# EAGLE design TD4Lite (EAGLE 9.2.2)
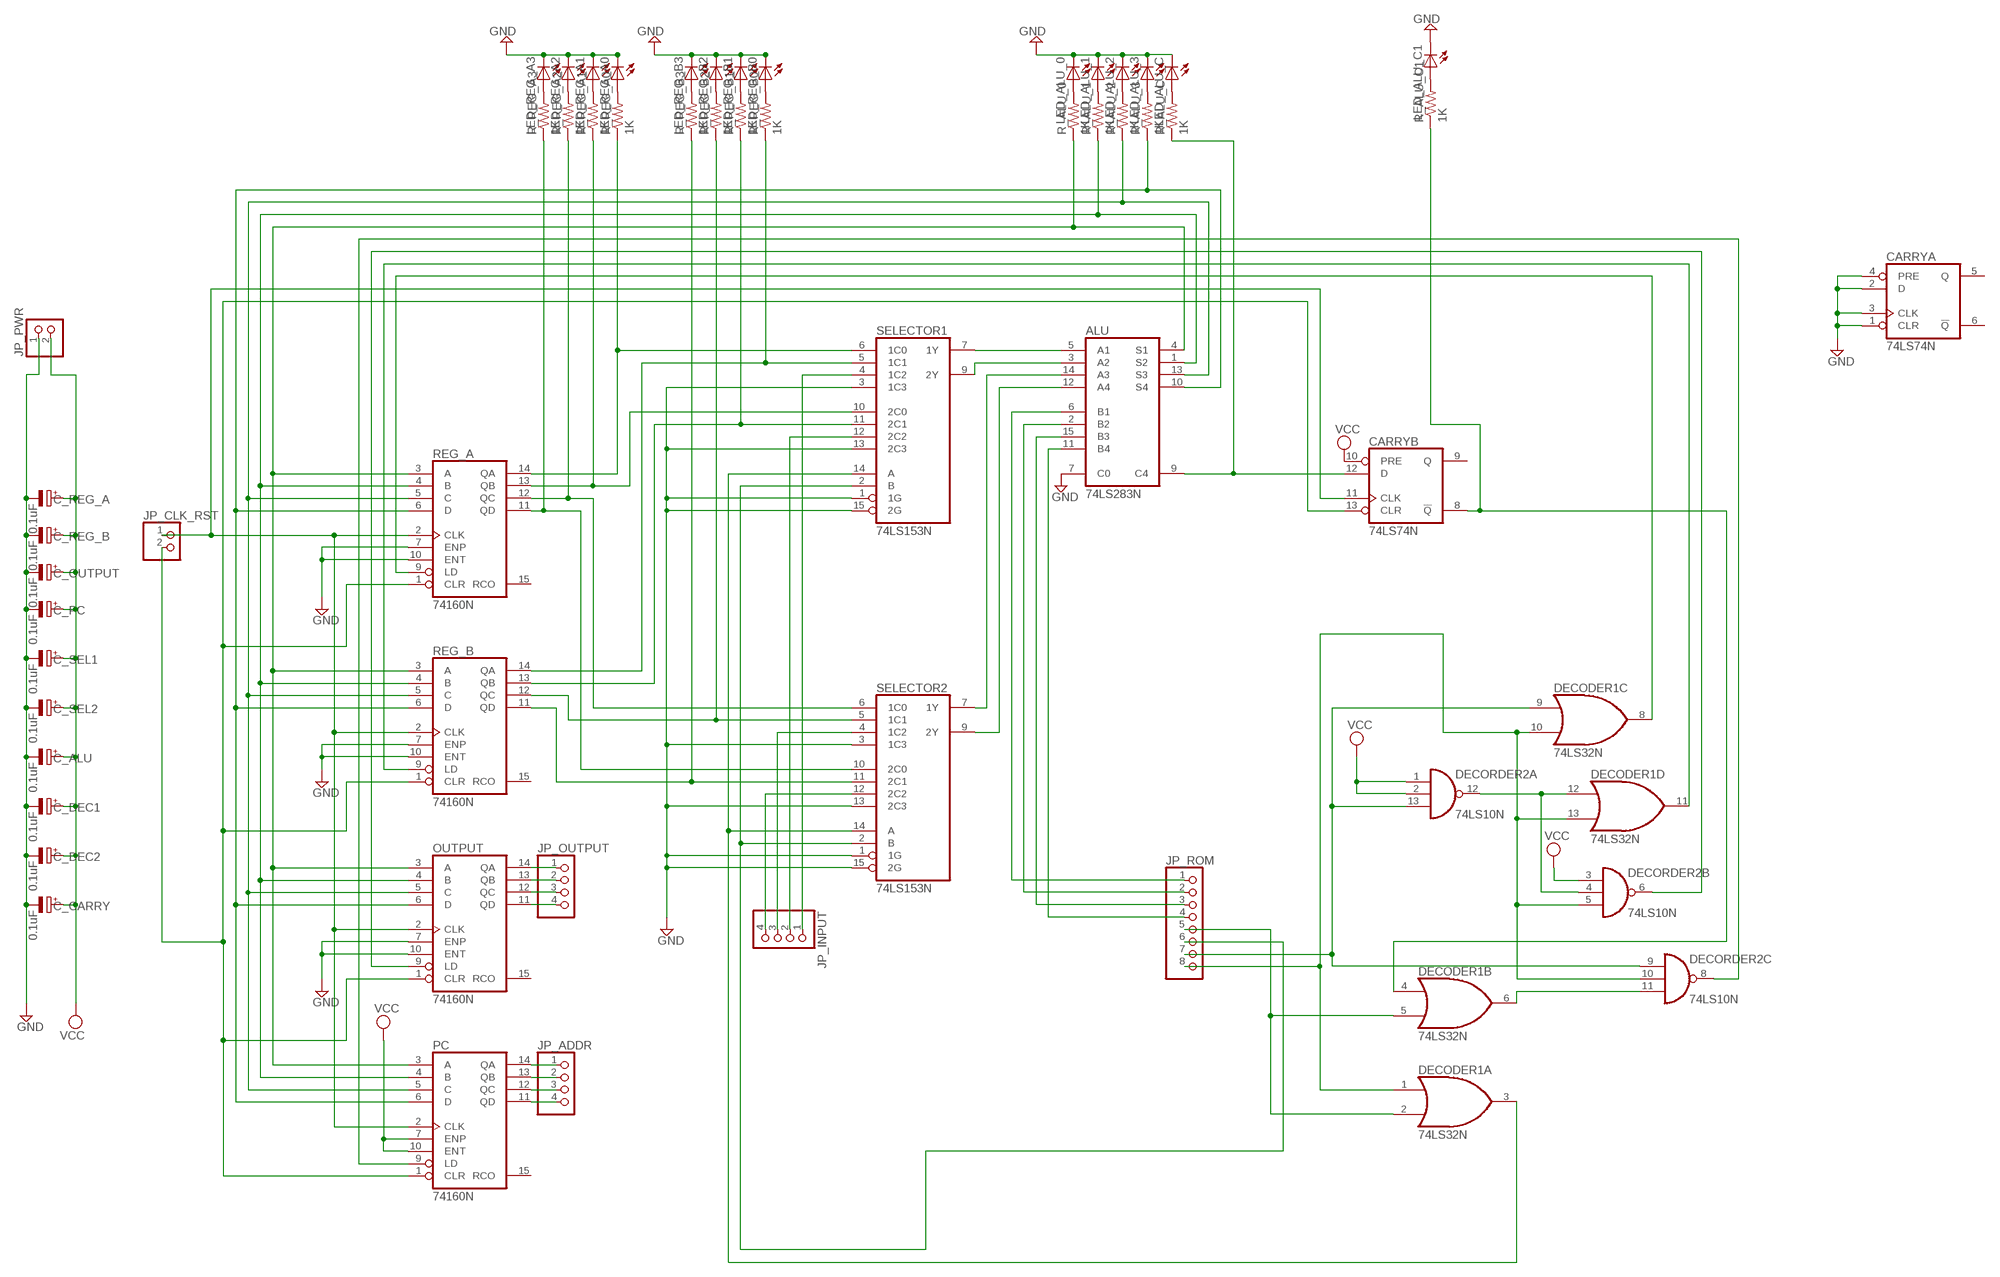
[diagram p0: schematic, sheet 1]

## Parts
ALU  74LS283N  [DIL16]
C_ALU  0.1uF  CPOL-EUE2-5  [E2-5]
C_CARRY  0.1uF  CPOL-EUE2-5  [E2-5]
C_DEC1  0.1uF  CPOL-EUE2-5  [E2-5]
C_DEC2  0.1uF  CPOL-EUE2-5  [E2-5]
C_OUTPUT  0.1uF  CPOL-EUE2-5  [E2-5]
C_PC  0.1uF  CPOL-EUE2-5  [E2-5]
C_REG_A  0.1uF  CPOL-EUE2-5  [E2-5]
C_REG_B  0.1uF  CPOL-EUE2-5  [E2-5]
C_SEL1  0.1uF  CPOL-EUE2-5  [E2-5]
C_SEL2  0.1uF  CPOL-EUE2-5  [E2-5]
CARRY  74LS74N  [DIL14]
DECODER1  74LS32N  [DIL14]
DECORDER2  74LS10N  [DIL14]
JP_ADDR  PINHD-1X4  [1X04]
JP_CLK_RST  PINHD-1X2  [1X02]
JP_INPUT  PINHD-1X4  [1X04]
JP_OUTPUT  PINHD-1X4  [1X04]
JP_PWR  PINHD-1X2  [1X02]
JP_ROM  PINHD-1X8  [1X08]
LED_ALU_0  LED5MM  [LED5MM]
LED_ALU_1  LED5MM  [LED5MM]
LED_ALU_2  LED5MM  [LED5MM]
LED_ALU_3  LED5MM  [LED5MM]
LED_ALU_C  LED5MM  [LED5MM]
LED_ALU_C1  LED5MM  [LED5MM]
LED_REG_A0  LED5MM  [LED5MM]
LED_REG_A1  LED5MM  [LED5MM]
LED_REG_A2  LED5MM  [LED5MM]
LED_REG_A3  LED5MM  [LED5MM]
LED_REG_B0  LED5MM  [LED5MM]
LED_REG_B1  LED5MM  [LED5MM]
LED_REG_B2  LED5MM  [LED5MM]
LED_REG_B3  LED5MM  [LED5MM]
OUTPUT  74160N  [DIL16]
PC  74160N  [DIL16]
R_ALU_0  1K  R-US_0204/7  [0204/7]
R_ALU_1  1K  R-US_0204/7  [0204/7]
R_ALU_2  1K  R-US_0204/7  [0204/7]
R_ALU_3  1K  R-US_0204/7  [0204/7]
R_ALU_C  1K  R-US_0204/7  [0204/7]
R_ALU_C1  1K  R-US_0204/7  [0204/7]
R_REG_A0  1K  R-US_0204/7  [0204/7]
R_REG_A1  1K  R-US_0204/7  [0204/7]
R_REG_A2  1K  R-US_0204/7  [0204/7]
R_REG_A3  1K  R-US_0204/7  [0204/7]
R_REG_B0  1K  R-US_0204/7  [0204/7]
R_REG_B1  1K  R-US_0204/7  [0204/7]
R_REG_B2  1K  R-US_0204/7  [0204/7]
R_REG_B3  1K  R-US_0204/7  [0204/7]
REG_A  74160N  [DIL16]
REG_B  74160N  [DIL16]
SELECTOR1  74LS153N  [DIL16]
SELECTOR2  74LS153N  [DIL16]

## Nets
CLK: CARRY.11(B:CLK) JP_CLK_RST.1 OUTPUT.2(CLK) PC.2(CLK) REG_A.2(CLK) REG_B.2(CLK)
DATA_0: ALU.6(B1) JP_ROM.1
DATA_1: ALU.2(B2) JP_ROM.2
DATA_2: ALU.15(B3) JP_ROM.3
DATA_3: ALU.11(B4) JP_ROM.4
DATA_4: DECODER1.2(A:I1) DECODER1.5(B:I1) JP_ROM.5
DATA_5: JP_ROM.6 SELECTOR1.2(B) SELECTOR2.2(B)
DATA_6: DECODER1.9(C:I0) DECORDER2.9(C:I0) DECORDER2.13(A:I2) JP_ROM.7
DATA_7: DECODER1.1(A:I0) DECODER1.10(C:I1) DECODER1.13(D:I1) DECORDER2.5(B:I2) DECORDER2.10(C:I1) JP_ROM.8
GND: ALU.7(C0) C_ALU.- C_CARRY.- C_DEC1.- C_DEC2.- C_OUTPUT.- C_PC.- C_REG_A.- C_REG_B.- C_SEL1.- C_SEL2.- CARRY.1(A:CLR) CARRY.2(A:D) CARRY.3(A:CLK) CARRY.4(A:PRE) JP_PWR.1 LED_ALU_0.K(C) LED_ALU_1.K(C) LED_ALU_2.K(C) LED_ALU_3.K(C) LED_ALU_C1.K(C) LED_ALU_C.K(C) LED_REG_A0.K(C) LED_REG_A1.K(C) LED_REG_A2.K(C) LED_REG_A3.K(C) LED_REG_B0.K(C) LED_REG_B1.K(C) LED_REG_B2.K(C) LED_REG_B3.K(C) OUTPUT.7(ENP) OUTPUT.10(ENT) REG_A.7(ENP) REG_A.10(ENT) REG_B.7(ENP) REG_B.10(ENT) SELECTOR1.1(1G) SELECTOR1.3(1C3) SELECTOR1.13(2C3) SELECTOR1.15(2G) SELECTOR2.1(1G) SELECTOR2.3(1C3) SELECTOR2.13(2C3) SELECTOR2.15(2G)
N$1: LED_ALU_0.A R_ALU_0.2
N$2: LED_ALU_1.A R_ALU_1.2
N$3: LED_ALU_2.A R_ALU_2.2
N$4: LED_ALU_3.A R_ALU_3.2
N$5: ALU.4(S1) OUTPUT.3(A) PC.3(A) R_ALU_0.1 REG_A.3(A) REG_B.3(A)
N$6: LED_ALU_C.A R_ALU_C.2
N$7: ALU.1(S2) OUTPUT.4(B) PC.4(B) R_ALU_1.1 REG_A.4(B) REG_B.4(B)
N$8: ALU.13(S3) OUTPUT.5(C) PC.5(C) R_ALU_2.1 REG_A.5(C) REG_B.5(C)
N$9: ALU.10(S4) OUTPUT.6(D) PC.6(D) R_ALU_3.1 REG_A.6(D) REG_B.6(D)
N$10: LED_ALU_C1.A R_ALU_C1.2
N$11: CARRY.8(B:!Q) DECODER1.4(B:I0) R_ALU_C1.1
N$18: LED_REG_A3.A R_REG_A3.2
N$19: LED_REG_A2.A R_REG_A2.2
N$20: LED_REG_A1.A R_REG_A1.2
N$21: LED_REG_A0.A R_REG_A0.2
N$22: LED_REG_B3.A R_REG_B3.2
N$23: LED_REG_B2.A R_REG_B2.2
N$24: LED_REG_B1.A R_REG_B1.2
N$25: LED_REG_B0.A R_REG_B0.2
N$26: JP_INPUT.1 SELECTOR1.4(1C2)
N$27: JP_INPUT.2 SELECTOR1.12(2C2)
N$28: JP_INPUT.3 SELECTOR2.4(1C2)
N$29: JP_INPUT.4 SELECTOR2.12(2C2)
N$30: ALU.5(A1) SELECTOR1.7(1Y)
N$31: ALU.3(A2) SELECTOR1.9(2Y)
N$32: ALU.14(A3) SELECTOR2.7(1Y)
N$33: ALU.12(A4) SELECTOR2.9(2Y)
N$34: JP_OUTPUT.4 OUTPUT.11(QD)
N$35: JP_OUTPUT.2 OUTPUT.13(QB)
N$36: JP_OUTPUT.1 OUTPUT.14(QA)
N$37: JP_OUTPUT.3 OUTPUT.12(QC)
N$38: JP_ADDR.1 PC.14(QA)
N$39: JP_ADDR.2 PC.13(QB)
N$40: JP_ADDR.3 PC.12(QC)
N$41: JP_ADDR.4 PC.11(QD)
N$46: ALU.9(C4) CARRY.12(B:D) R_ALU_C.1
N$47: DECODER1.3(A:O) SELECTOR1.14(A) SELECTOR2.14(A)
N$52: DECODER1.8(C:O) REG_A.9(LD)
N$53: DECODER1.12(D:I0) DECORDER2.4(B:I1) DECORDER2.12(A:O)
N$54: DECODER1.11(D:O) REG_B.9(LD)
N$56: DECODER1.6(B:O) DECORDER2.11(C:I2)
N$57: DECORDER2.6(B:O) OUTPUT.9(LD)
N$59: DECORDER2.8(C:O) PC.9(LD)
REG_A0: R_REG_A0.1 REG_A.14(QA) SELECTOR1.6(1C0)
REG_A1: R_REG_A1.1 REG_A.13(QB) SELECTOR1.10(2C0)
REG_A2: R_REG_A2.1 REG_A.12(QC) SELECTOR2.6(1C0)
REG_A3: R_REG_A3.1 REG_A.11(QD) SELECTOR2.10(2C0)
REG_B0: R_REG_B0.1 REG_B.14(QA) SELECTOR1.5(1C1)
REG_B1: R_REG_B1.1 REG_B.13(QB) SELECTOR1.11(2C1)
REG_B2: R_REG_B2.1 REG_B.12(QC) SELECTOR2.5(1C1)
REG_B3: R_REG_B3.1 REG_B.11(QD) SELECTOR2.11(2C1)
RST: CARRY.13(B:CLR) JP_CLK_RST.2 OUTPUT.1(CLR) PC.1(CLR) REG_A.1(CLR) REG_B.1(CLR)
VCC: C_ALU.+ C_CARRY.+ C_DEC1.+ C_DEC2.+ C_OUTPUT.+ C_PC.+ C_REG_A.+ C_REG_B.+ C_SEL1.+ C_SEL2.+ CARRY.10(B:PRE) DECORDER2.1(A:I0) DECORDER2.2(A:I1) DECORDER2.3(B:I0) JP_PWR.2 PC.7(ENP) PC.10(ENT)
Unconnected: CARRY.5(A:Q) CARRY.6(A:!Q) CARRY.9(B:Q) OUTPUT.15(RCO) PC.15(RCO) REG_A.15(RCO) REG_B.15(RCO)

## Power pins joined to a net without a drawn wire
GND: ALU.8(GND) CARRY.7(P:GND) DECODER1.7(P:GND) DECORDER2.7(P:GND) OUTPUT.8(GND) PC.8(GND) REG_A.8(GND) REG_B.8(GND) SELECTOR1.8(GND) SELECTOR2.8(GND)
VCC: ALU.16(VCC) CARRY.14(P:VCC) DECODER1.14(P:VCC) DECORDER2.14(P:VCC) OUTPUT.16(VCC) PC.16(VCC) REG_A.16(VCC) REG_B.16(VCC) SELECTOR1.16(VCC) SELECTOR2.16(VCC)

## Library data of the parts
ALU = 74xx-us:74*283: 4-bit binary FULL ADDER, fast carry
C_ALU C_CARRY C_DEC1 C_DEC2 C_OUTPUT C_PC C_REG_A C_REG_B C_SEL1 C_SEL2 = rcl:CPOL-EU: POLARIZED CAPACITOR, European symbol; SPICEPREFIX: C
CARRY = 74xx-us:74*74: Dual D type positive edge triggered FLIP FLOP, preset and clear
DECODER1 = 74xx-us:74*32: Quad 2-input OR gate
DECORDER2 = 74xx-eu:74*10: Triple 3-input NAND gate
JP_ADDR JP_INPUT JP_OUTPUT = pinhead:PINHD-1X4: PIN HEADER
JP_CLK_RST JP_PWR = pinhead:PINHD-1X2: PIN HEADER
JP_ROM = pinhead:PINHD-1X8: PIN HEADER
LED_ALU_0 LED_ALU_1-LED_ALU_3 LED_ALU_C LED_ALU_C1 LED_REG_A0 LED_REG_A1-LED_REG_A3 LED_REG_B0 LED_REG_B1-LED_REG_B3 = led:LED: LED OSRAM: - CHIPLED LG R971, LG N971, LY N971, LG Q971, LY Q971, LO R971, LY R971 LH N974, LH R974 LS Q976, LO Q976, LY Q976 LO Q996 - Hyper CHIPLED LW Q18S LB Q993, LB Q99A, LB R99A - SideLED LS A670, LO A670, LY A670, LG A670, LP A670 LB A673, LV A673, LT A673, LW A673 LH A674 LY A675 LS A676, LA A676, LO A676, LY A676, LW A676 LS A679, LY A679, LG A679 - Hyper Micro SIDELED® LS Y876, LA Y876, LO Y876, LY Y876 LT Y87S - SmartLED LW L88C, LW L88S LB L89C, LB L89S, LG L890 LS L89K, LO L89K, LY L89K LS L896, LA L896, LO L896, LY L896 - TOPLED LS T670, LO T670, LY T670, LG T670, LP T670 LSG T670, LSP T670, LSY T670, LOP T670, LYG T670 LG T671, LOG T671, LSG T671 LB T673, LV T673, LT T673, LW T673 LH T674 LS T676, LA T676, LO T676, LY T676, LB T676, LH T676, LSB T676, LW T676 LB T67C, LV T67C, LT T67C, LS T67K, LO T67K, LY T67K, LW E67C LS E67B, LA E67B, LO E67B, LY E67B, LB E67C, LV E67C, LT E67C LW T67C LS T679, LY T679, LG T679 LS T770, LO T770, LY T770, LG T770, LP T770 LB T773, LV T773, LT T773, LW T773 LH T774 LS E675, LA E675, LY E675, LS T675 LS T776, LA T776, LO T776, LY T776, LB T776 LHGB T686 LT T68C, LB T68C - Hyper Mini TOPLED® LB M676 - Mini TOPLED Santana® LG M470 LS M47K, LO M47K, LY M47K Source: http://www.osram.convergy.de LUXEON: - LUMILED® LXK2-PW12-R00, LXK2-PW12-S00, LXK2-PW14-U00, LXK2-PW14-V00 LXK2-PM12-R00, LXK2-PM12-S00, LXK2-PM14-U00 LXK2-PE12-Q00, LXK2-PE12-R00, LXK2-PE12-S00, LXK2-PE14-T00, LXK2-PE14-U00 LXK2-PB12-K00, LXK2-PB12-L00, LXK2-PB12-M00, LXK2-PB14-N00, LXK2-PB14-P00, LXK2-PB14-Q00 LXK2-PR12-L00, LXK2-PR12-M00, LXK2-PR14-Q00, LXK2-PR14-R00 LXK2-PD12-Q00, LXK2-PD12-R00, LXK2-PD12-S00 LXK2-PH12-R00, LXK2-PH12-S00 LXK2-PL12-P00, LXK2-PL12-Q00, LXK2-PL12-R00 Source: www.luxeon.com KINGBRIGHT: KA-3528ASYC Source: www.kingbright.com
OUTPUT PC REG_A REG_B = 74xx-us:74*160: Synchronous 4-bit COUNTER
R_ALU_0 R_ALU_1-R_ALU_3 R_ALU_C R_ALU_C1 R_REG_A0 R_REG_A1-R_REG_A3 R_REG_B0 R_REG_B1-R_REG_B3 = rcl:R-US_: RESISTOR, American symbol; SPICEPREFIX: R
SELECTOR1 SELECTOR2 = 74xx-us:74*153: Dual 4-line to 1-line data SELECTOR/MULTIPLEXER

## Board
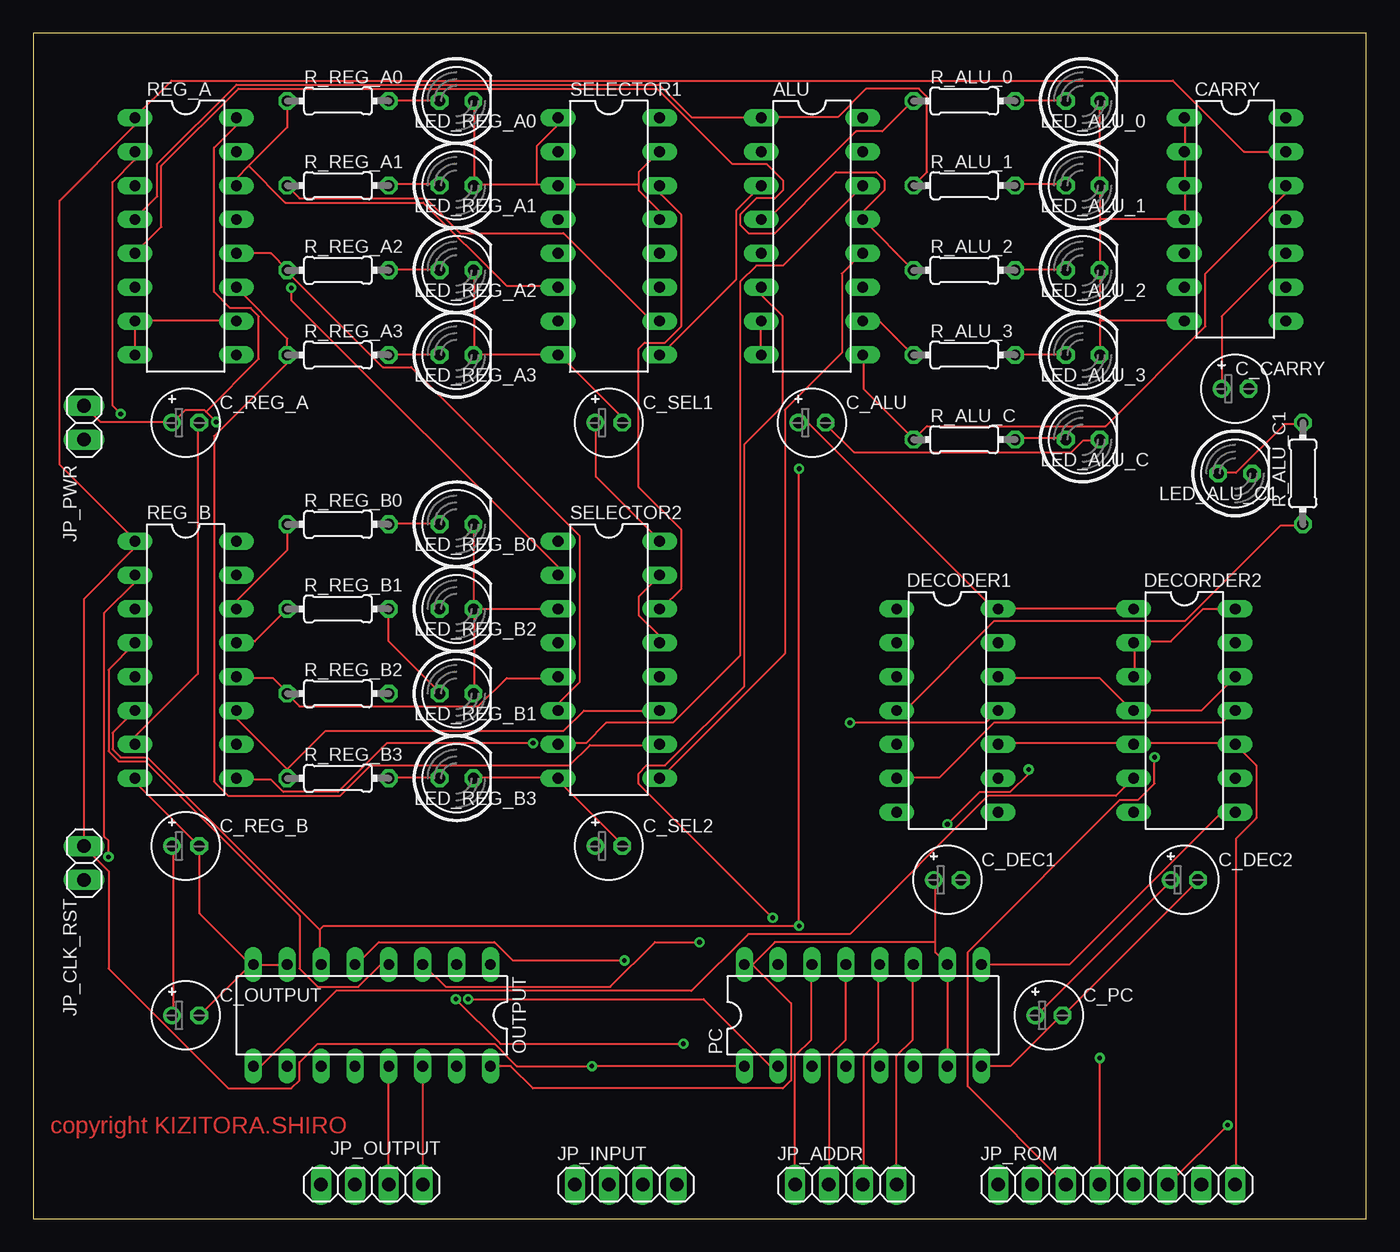
[diagram p1: board, top side]
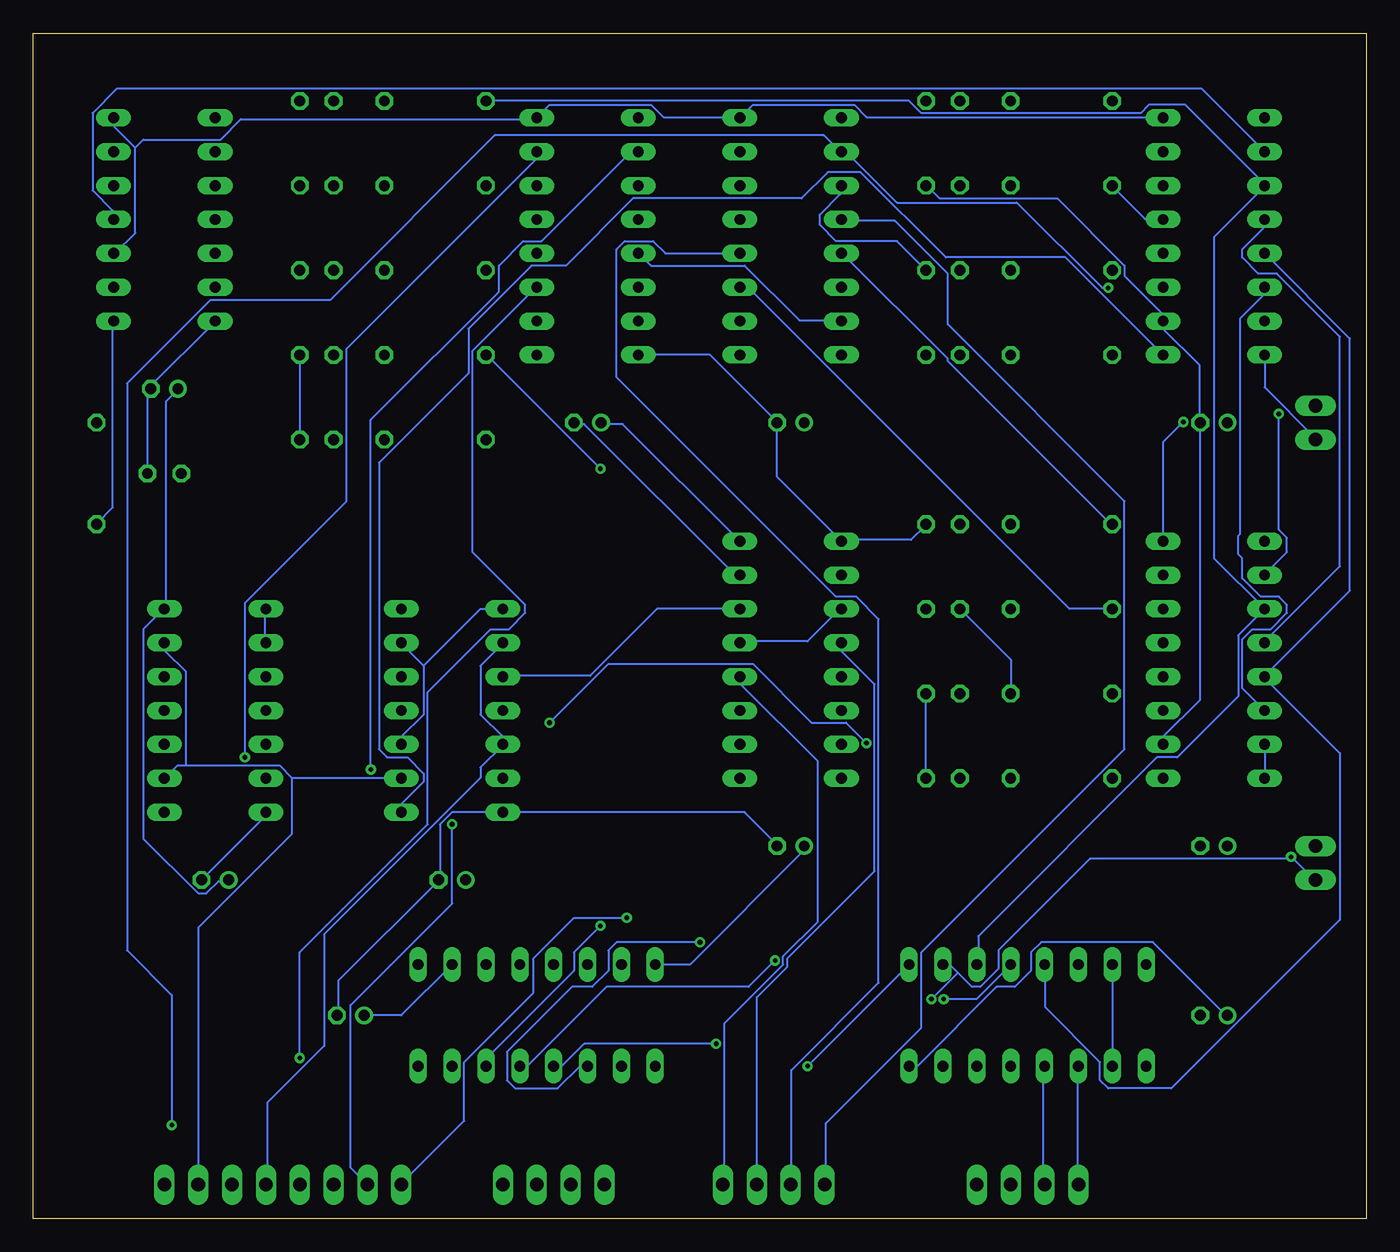
[diagram p2: board, bottom side, seen from below]

Size 100 x 88.89 mm. Coordinates in mm from the lower left corner, seen from the top.
Outline: 0,0 100,0 100,88.89 0,88.89 0,0
Copper layers (1*16): Top 0.035mm / dielectric 1.5mm / Bottom 0.035mm
Design rules "default": minimum track width 6mil, minimum drill 0.35mm, track to track 6mil, track to pad 6mil, pad to pad 6mil, via to via 6mil, smd to smd 6mil, copper to edge 40mil, drill to drill 6mil, minimum pad ring 10mil, minimum via ring 8mil, stop-mask expansion 4mil, vias tented up to drill 0mil, thermal gap 10mil

### Footprints (pad centres in the part's own frame; a part is rotated, then mirrored left to right if it is on the bottom)
DIL16 = drill 0.813 long: 1 -8.89,-3.81; 2 -6.35,-3.81; 3 -3.81,-3.81; 4 -1.27,-3.81; 5 1.27,-3.81; 6 3.81,-3.81; 7 6.35,-3.81; 8 8.89,-3.81; 9 8.89,3.81; 10 6.35,3.81; 11 3.81,3.81; 12 1.27,3.81; 13 -1.27,3.81; 14 -3.81,3.81; 15 -6.35,3.81; 16 -8.89,3.81
E2-5 = drill 0.813 pad 1.27: + -1.016,0 | drill 0.813 pad 1.27 octagon: - 1.016,0
DIL14 = drill 0.813 long: 1 -7.62,-3.81; 2 -5.08,-3.81; 3 -2.54,-3.81; 4 0,-3.81; 5 2.54,-3.81; 6 5.08,-3.81; 7 7.62,-3.81; 8 7.62,3.81; 9 5.08,3.81; 10 2.54,3.81; 11 0,3.81; 12 -2.54,3.81; 13 -5.08,3.81; 14 -7.62,3.81
1X04 = drill 1.016 long: 1 -3.81,0; 2 -1.27,0; 3 1.27,0; 4 3.81,0
1X02 = drill 1.016 long: 1 -1.27,0; 2 1.27,0
1X08 = drill 1.016 long: 1 -8.89,0; 2 -6.35,0; 3 -3.81,0; 4 -1.27,0; 5 1.27,0; 6 3.81,0; 7 6.35,0; 8 8.89,0
LED5MM = drill 0.813 octagon: A -1.27,0; K 1.27,0
0204/7 = drill 0.813 octagon: 1 -3.81,0; 2 3.81,0

### Placement (x,y rotation side)
ALU  58.42,73.66 270 top
C_ALU  58.42,59.69 0 top
C_CARRY  90.17,62.23 0 top
C_DEC1  68.58,25.4 0 top
C_DEC2  86.36,25.4 0 top
C_OUTPUT  11.43,15.24 0 top
C_PC  76.2,15.24 0 top
C_REG_A  11.43,59.69 0 top
C_REG_B  11.43,27.94 0 top
C_SEL1  43.18,59.69 0 top
C_SEL2  43.18,27.94 0 top
CARRY  90.17,74.93 270 top
DECODER1  68.58,38.1 270 top
DECORDER2  86.36,38.1 270 top
JP_ADDR  60.96,2.54 0 top
JP_CLK_RST  3.81,26.67 90 top
JP_INPUT  44.45,2.54 0 top
JP_OUTPUT  25.4,2.54 180 top
JP_PWR  3.81,59.69 90 top
JP_ROM  81.28,2.54 0 top
LED_ALU_0  78.74,83.82 0 top
LED_ALU_1  78.74,77.47 0 top
LED_ALU_2  78.74,71.12 0 top
LED_ALU_3  78.74,64.77 0 top
LED_ALU_C  78.74,58.42 0 top
LED_ALU_C1  90.17,55.88 0 top
LED_REG_A0  31.75,83.82 0 top
LED_REG_A1  31.75,77.47 0 top
LED_REG_A2  31.75,71.12 0 top
LED_REG_A3  31.75,64.77 0 top
LED_REG_B0  31.75,52.07 0 top
LED_REG_B1  31.75,39.37 0 top
LED_REG_B2  31.75,45.72 0 top
LED_REG_B3  31.75,33.02 0 top
OUTPUT  25.4,15.24 180 top
PC  62.23,15.24 0 top
R_ALU_0  69.85,83.82 0 top
R_ALU_1  69.85,77.47 0 top
R_ALU_2  69.85,71.12 0 top
R_ALU_3  69.85,64.77 0 top
R_ALU_C  69.85,58.42 0 top
R_ALU_C1  95.25,55.88 90 top
R_REG_A0  22.86,83.82 0 top
R_REG_A1  22.86,77.47 0 top
R_REG_A2  22.86,71.12 0 top
R_REG_A3  22.86,64.77 0 top
R_REG_B0  22.86,52.07 0 top
R_REG_B1  22.86,45.72 0 top
R_REG_B2  22.86,39.37 0 top
R_REG_B3  22.86,33.02 0 top
REG_A  11.43,73.66 270 top
REG_B  11.43,41.91 270 top
SELECTOR1  43.18,73.66 270 top
SELECTOR2  43.18,41.91 270 top

### Tracks (layer width: path | path; a pad name or v marks a point on that pad's centre or on a via)
CLK  (via drill 0.35)
  Top 0.152: REG_B.2 7.62,47.7 5.33,45.41 5.33,28.65 5.64,28.35 v5.64,27.13 | REG_A.2 7.62,79.4 5.94,77.72 5.94,60.96 v6.55,60.35 | PC.2 55.32,11.43 50.29,16.46 v32.61,16.46
  Bottom 0.152: 5.49,26.98 3.81,25.3 JP_CLK_RST.1 | v6.55,60.35 6.55,51.66 5.94,51.05 5.94,49.99 7.62,48.31 REG_B.2 | OUTPUT.2 31.24,19.05 30.63,18.44 | 30.63,18.44 29.57,17.37 28.96,17.37 27.58,18.75 27.58,20.12 20.73,26.98 5.49,26.98 | 5.49,26.98 v5.64,27.13 | 30.63,18.44 v32.61,16.46 | REG_A.2 12.34,84.73 93.73,84.73 95.56,82.91 95.56,77.11 94.03,75.59 94.03,74.98 CARRY.11
DATA_0  (via drill 0.35)
  Top 0.152: v55.47,22.55 45.41,32.61 45.41,33.38 46.02,33.98 47.4,33.98 53.34,39.93 53.34,58.06 56.24,60.96 56.24,67.67 54.71,69.19 54.71,69.8 ALU.6
  Bottom 0.152: v55.47,22.55 59.44,22.55 62.48,19.51 62.48,16.92 67.67,11.73 67.67,7.32 72.39,2.59 JP_ROM.1
DATA_1  (via drill 0.35)
  Top 0.152: v74.68,33.68 74.68,33.38 73.3,32 71.02,32 v68.58,29.57
  Bottom 0.152: ALU.2 55.17,80.01 61.87,73.3 63.25,73.3 65.08,71.48 65.08,69.49 74.68,59.89 v74.68,33.68 | v68.58,29.57 68.58,23.62 76.2,16 76.2,3.81 JP_ROM.2
DATA_2  (via drill 0.35)
  Top 0.152: v84.12,34.59 84.12,32.61 82.91,31.39 81.53,31.39 70.1,19.96 70.1,9.91 JP_ROM.3
  Bottom 0.152: v84.12,34.59 84.12,46.18 76.5,53.8 76.5,65.23 62.33,79.4 62.33,80.01 ALU.15
DATA_3  (via drill 0.35)
  Top 0.152: JP_ROM.4 v80.01,12.04
  Bottom 0.152: v80.01,12.04 80.01,19.96 70.41,29.57 70.41,39.47 65.68,44.2 64.31,44.2 63.09,45.41 63.09,46.02 67.06,49.99 67.06,65.08 62.33,69.8 ALU.11
DATA_4
  Bottom 0.152: DECODER1.2 64.77,43.13 66.45,41.45 66.45,37.8 64.77,36.12 DECODER1.5 64.77,35.51 66.45,33.83 66.45,33.07 78.18,21.34 78.18,12.95 82.45,8.69 82.45,2.59 JP_ROM.5
DATA_5  (via drill 0.35)
  Top 0.152: v19.36,69.8 19.36,68.89 39.32,48.92 39.32,48.31 SELECTOR2.2 | v89.61,7.01 85.19,2.59 JP_ROM.6
  Bottom 0.152: v19.36,69.8 19.81,69.8 26.21,76.2 35.2,76.2 39.01,80.01 SELECTOR1.2 39.47,80.01 40.69,81.23 65.38,81.23 77.72,68.89 86.72,68.89 92.96,62.64 92.96,20.12 89.61,16.76 v89.61,7.01
DATA_6
  Bottom 0.152: 80.62,33.07 72.39,33.07 DECODER1.9 | 80.62,33.07 81.53,33.98 88.54,33.98 | 88.54,33.98 89.15,33.98 90.07,33.07 DECORDER2.9 | 88.54,33.98 88.54,41 90.07,42.52 90.07,43.13 DECORDER2.13 | JP_ROM.7 87.63,21.79 80.62,28.8 80.62,33.07
DATA_7
  Top 0.152: JP_ROM.8 90.22,2.59 90.22,28.5 91.75,30.02 91.75,33.98 DECORDER2.10 90.07,35.66 82.6,35.66 DECORDER2.5 82.45,35.66 72.39,35.66 DECODER1.10
  Bottom 0.152: DECODER1.10 72.39,36.12 70.71,37.8 70.71,41.45 | 70.71,41.45 72.39,43.13 DECODER1.13 | DECODER1.1 66.45,45.72 70.71,41.45
GND
  Top 0.152: REG_B.8 7.62,32.77 C_REG_B.- 12.5,27.89 12.5,22.86 16.31,19.05 | 16.31,19.05 12.5,15.24 C_OUTPUT.- | OUTPUT.8 16.31,19.05 | OUTPUT.8 OUTPUT.7 | 16.46,19.05 OUTPUT.8 | REG_A.8 REG_A.7 7.62,67.36 15.24,67.36 REG_A.10 | REG_B.7 7.62,36.12 12.34,40.84 12.34,59.59 C_REG_A.- | 45.41,77.57 45.41,78.49 46.94,80.01 SELECTOR1.15 | 45.41,77.57 45.41,77.11 46.94,75.59 46.94,74.98 SELECTOR1.13 | 33.07,77.57 33.07,83.82 LED_REG_A0.K | 33.07,77.57 37.8,77.57 | 37.8,77.57 39.32,77.57 SELECTOR1.3 39.47,77.57 45.41,77.57 | 33.07,77.57 LED_REG_A1.K | 37.8,77.57 37.8,80.47 39.32,81.99 39.32,82.45 SELECTOR1.1 | 33.07,64.77 33.07,71.02 LED_REG_A2.K | ALU.8 54.56,64.77 54.56,67.21 ALU.7 | C_SEL1.- 44.2,60.05 39.47,64.77 SELECTOR1.8 33.07,64.77 | 33.07,64.77 LED_REG_A3.K | PC.8 73.3,11.43 77.11,15.24 C_PC.- 77.27,15.24 87.33,25.3 C_DEC2.- | 86.41,80.01 86.41,82.45 CARRY.1 | 86.41,80.01 86.41,77.57 CARRY.3 86.41,77.42 86.41,74.98 CARRY.4 86.26,74.98 80.01,74.98 | 86.41,80.01 CARRY.2 | 80.01,74.98 LED_ALU_1.K LED_ALU_0.K | 80.01,74.98 LED_ALU_2.K 80.01,67.36 | 80.01,67.36 LED_ALU_3.K | 80.01,67.36 86.26,67.36 CARRY.7 | SELECTOR2.13 46.94,43.28 46.94,43.74 45.41,45.26 45.41,46.63 46.94,48.16 SELECTOR2.15 | LED_REG_B3.K 33.07,33.07 39.32,33.07 SELECTOR2.8 39.32,32.92 44.2,28.04 C_SEL2.- | 33.07,45.72 33.07,39.47 LED_REG_B1.K | 33.07,45.72 33.07,51.97 LED_REG_B0.K | 33.07,45.72 SELECTOR2.3 | 33.07,45.72 LED_REG_B2.K | LED_ALU_C.K 80.01,58.37 78.79,58.37 77.88,57.45 61.57,57.45 59.44,59.59 C_ALU.-
  Bottom 0.152: REG_B.7 REG_B.8 | OUTPUT.7 OUTPUT.10 | REG_A.8 7.62,62.33 3.81,58.52 JP_PWR.1 | REG_B.10 15.24,36.12 12.5,38.86 12.5,59.59 C_REG_A.- 12.5,59.74 12.5,64.01 15.24,66.75 REG_A.10 15.24,67.82 18.14,70.71 18.14,71.48 23.16,76.5 32,76.5 32.92,77.42 LED_REG_A1.K | ALU.8 49.23,64.77 44.2,59.74 C_SEL1.- 44.2,55.63 SELECTOR2.1 39.32,50.9 34.14,50.9 33.07,51.97 LED_REG_B0.K | LED_REG_A2.K 35.2,73.3 39.78,73.3 41,74.52 41,75.29 39.47,76.81 39.47,77.42 SELECTOR1.3 | C_DEC2.- 82.6,30.18 82.6,30.48 DECORDER2.7 | C_PC.- 77.11,15.24 77.11,17.83 69.65,25.3 C_DEC1.- 69.49,25.45 69.49,29.57 68.58,30.48 DECODER1.7 46.63,30.48 44.2,28.04 C_SEL2.- | CARRY.7 86.41,67.21 91.29,62.33 C_CARRY.- 91.29,62.18 91.44,62.03 LED_ALU_C1.K | LED_ALU_3.K LED_ALU_C.K | C_ALU.- 59.44,59.59 58.67,59.59 47.4,48.31 47.09,48.31 SELECTOR2.15 | LED_REG_B3.K 33.07,33.07 33.07,39.32 LED_REG_B1.K | SELECTOR2.13 46.94,43.28 41.91,43.28 39.47,45.72 SELECTOR2.3
N$1
  Top 0.152: LED_ALU_0.A R_ALU_0.2
N$2
  Top 0.152: R_ALU_1.2 73.76,77.57 77.42,77.57 LED_ALU_1.A
N$3
  Top 0.152: R_ALU_2.2 73.76,71.17 77.42,71.17 LED_ALU_2.A
N$4
  Top 0.152: LED_ALU_3.A R_ALU_3.2
N$5  (via drill 0.35)
  Top 0.152: ALU.4 54.71,74.98 55.17,74.98 61.72,81.53 63.7,81.53 65.99,83.82 R_ALU_0.1 | v49.99,20.73 46.63,20.73 43.28,17.37 30.94,17.37 29.26,19.05 OUTPUT.3
  Bottom 0.152: OUTPUT.3 29.11,19.05 29.11,21.18 15.7,34.59 14.17,34.59 9.6,39.17 9.6,43.74 REG_B.3 11.43,49.53 11.43,73.61 7.62,77.42 REG_A.3 7.62,77.57 13.56,83.52 16.31,83.52 16.92,82.91 33.38,82.91 34.29,83.82 R_ALU_0.1 | PC.3 58.98,11.43 60.66,9.75 63.86,9.75 64.47,10.36 64.47,12.5 59.59,17.37 58.06,17.37 56.84,18.59 56.84,20.12 56.24,20.73 v49.99,20.73
N$6
  Top 0.152: R_ALU_C.2 73.76,58.52 77.42,58.52 LED_ALU_C.A
N$7  (via drill 0.35)
  Top 0.152: R_ALU_1.1 67.06,78.49 67.06,84.12 66.45,84.73 62.48,84.73 60.35,82.6 54.71,82.6 ALU.1 54.56,82.6 49.38,82.6 46.94,85.04 15.24,85.04 9.3,79.1 9.3,76.66 7.62,74.98 REG_A.4 | OUTPUT.4 26.06,19.05 24.38,17.37 21.34,17.37 19.96,18.75 19.96,22.71 8.38,34.29 6.4,34.29 5.64,35.05 5.64,41.15 7.62,43.13 REG_B.4 | v48.77,13.11 35.05,13.11 v31.7,16.46
  Bottom 0.152: PC.4 60.35,11.43 58.67,13.11 v48.77,13.11 | v31.7,16.46 29.26,16.46 OUTPUT.4 | REG_A.4 7.62,74.37 9.3,72.69 9.3,72.08 8.08,70.87 6.71,70.87 1.98,66.14 1.98,48.92 7.62,43.28 REG_B.4
N$8  (via drill 0.35)
  Top 0.152: R_ALU_2.1 ALU.13 62.33,74.98 62.33,75.59 63.86,77.11 63.86,77.88 63.25,78.49 60.2,78.49 55.63,73.91 53.65,73.91 53.03,74.52 53.03,75.29 54.25,76.5 55.63,76.5 56.24,77.11 56.24,77.88 55.02,79.1 52.43,79.1 46.79,84.73 15.39,84.73 9.6,78.94 9.6,74.37 REG_A.5 | v44.35,19.36 35.97,19.36 34.59,20.73 25.91,20.73 24.23,19.05 OUTPUT.5
  Bottom 0.152: OUTPUT.5 24.08,19.05 24.08,15.85 19.96,11.73 19.96,10.36 19.36,9.75 14.63,9.75 1.98,22.4 1.98,34.9 7.62,40.54 REG_B.5 7.62,40.69 1.22,47.09 1.22,65.99 REG_A.5 | PC.5 62.94,11.43 57,17.37 46.33,17.37 v44.35,19.36
N$9  (via drill 0.35)
  Top 0.152: ALU.10 62.33,67.21 63.55,67.21 65.99,64.77 R_ALU_3.1 | 21.49,21.64 21.49,19.05 OUTPUT.6 | 21.49,21.64 8.53,34.59 6.55,34.59 5.94,35.2 5.94,36.42 REG_B.6 | 21.49,21.64 21.79,21.95 v57.45,21.95 v57.45,56.24
  Bottom 0.152: v57.45,21.95 59.44,19.96 59.44,18.59 65.99,12.04 65.99,11.43 PC.6 | REG_A.6 7.62,69.34 9.45,67.51 9.45,51.36 9.6,51.21 9.6,49.84 9.3,49.53 9.3,48.01 7.92,46.63 6.55,46.63 5.94,46.02 5.94,45.41 7.16,44.2 8.53,44.2 9.3,43.43 9.3,39.78 REG_B.6 | v57.45,56.24 65.99,64.77 R_ALU_3.1
N$10
  Top 0.152: LED_ALU_C1.A 89,55.93 90.22,55.93 93.88,59.59 95.25,59.59 R_ALU_C1.2
N$11
  Top 0.152: DECODER1.4 65.38,38.1 72.08,44.81 86.41,44.81 93.57,51.97 95.25,51.97 R_ALU_C1.1
  Bottom 0.152: CARRY.8 94.03,67.21 94.03,53.34 95.25,52.12 R_ALU_C1.1
N$18
  Top 0.152: LED_REG_A3.A R_REG_A3.2
N$19
  Top 0.152: R_REG_A2.2 26.67,71.17 30.48,71.17 LED_REG_A2.A
N$20
  Top 0.152: R_REG_A1.2 26.67,77.57 30.48,77.57 LED_REG_A1.A
N$21
  Top 0.152: LED_REG_A0.A R_REG_A0.2
N$22
  Top 0.152: R_REG_B3.2 26.67,33.07 30.48,33.07 LED_REG_B3.A
N$23
  Bottom 0.152: R_REG_B2.2 26.67,41.91 LED_REG_B2.A
N$24
  Top 0.152: R_REG_B1.2 26.67,43.28 30.48,39.47 LED_REG_B1.A
N$25
  Top 0.152: R_REG_B0.2 26.67,52.12 30.48,52.12 LED_REG_B0.A
N$26
  Bottom 0.152: SELECTOR1.4 39.32,74.83 35.36,74.83 31.39,70.87 31.39,67.06 18.14,53.8 18.14,35.2 33.38,19.96 33.38,14.33 40.54,7.16 40.54,2.59 JP_INPUT.1
N$27
  Bottom 0.152: SELECTOR1.12 52.58,72.39 53.49,73.3 55.63,73.3 56.24,72.69 56.24,63.09 39.78,46.63 38.25,46.63 36.58,44.96 36.58,17.68 43.13,11.12 43.13,2.59 JP_INPUT.2
N$28
  Bottom 0.152: JP_INPUT.3 45.72,16.61 43.43,18.9 43.43,19.51 36.88,26.06 36.88,40.08 39.32,42.52 39.32,43.13 SELECTOR2.4
N$29
  Bottom 0.152: SELECTOR2.12 46.94,40.54 46.94,40.08 41.15,34.29 41.15,22.25 43.74,19.66 43.74,19.05 48.16,14.63 48.16,2.59 JP_INPUT.4
N$30
  Bottom 0.152: SELECTOR1.7 39.47,67.36 42.52,67.36 46.63,71.48 53.65,71.48 54.56,72.39 ALU.5
N$31
  Top 0.152: ALU.3 52.73,75.59 52.73,70.41 47.09,64.77 SELECTOR1.9
N$32
  Top 0.152: ALU.14 56.24,71.48 54.25,71.48 53.03,70.26 53.03,42.22 48.01,37.19 42.98,37.19 41.45,35.66 39.47,35.66 SELECTOR2.7
N$33
  Top 0.152: SELECTOR2.9 47.09,33.07 56.39,42.37 56.39,60.66 60.66,64.92 60.66,70.87 62.18,72.39 ALU.12
N$34
  Bottom 0.152: OUTPUT.11 21.64,11.43 21.64,2.59 JP_OUTPUT.4
N$35
  Top 0.152: JP_OUTPUT.2 OUTPUT.13
N$36
  Top 0.152: OUTPUT.14 29.26,11.43 29.26,2.59 JP_OUTPUT.1
N$37
  Bottom 0.152: OUTPUT.12 24.23,11.43 24.23,2.59 JP_OUTPUT.3
N$38
  Top 0.152: JP_ADDR.1 57.15,12.19 58.37,13.41 58.37,19.05 PC.14
N$39
  Top 0.152: PC.13 60.96,13.41 59.74,12.19 59.74,2.59 JP_ADDR.2
N$40
  Top 0.152: PC.12 63.4,19.05 63.4,13.26 62.33,12.19 62.33,2.59 JP_ADDR.3
N$41
  Top 0.152: JP_ADDR.4 64.77,12.19 65.99,13.41 65.99,19.05 PC.11
N$46
  Top 0.152: ALU.9 62.33,64.77 62.33,62.18 65.99,58.52 R_ALU_C.1 67.06,59.44 80.47,59.44 87.94,66.9 87.94,70.87 93.88,76.81 93.88,77.42 CARRY.12
N$47
  Top 0.152: SELECTOR1.14 47.09,77.42 47.09,76.81 48.62,75.29 48.62,66.9 47.4,65.68 45.87,65.68 45.41,65.23 45.41,54.86 48.62,51.66 48.62,47.24 47.09,45.72 SELECTOR2.14
  Bottom 0.152: SELECTOR2.14 53.19,45.72 58.22,40.69 64.77,40.69 DECODER1.3
N$52
  Bottom 0.152: DECODER1.8 72.39,31.09 70.71,32.77 70.71,33.38 71.93,34.59 73.46,34.59 74.07,35.2 74.07,56.69 67.36,63.4 67.36,66.75 62.64,71.48 60.05,71.48 55.02,76.5 42.37,76.5 40.39,78.49 37.95,78.49 31.55,72.08 22.55,72.08 REG_A.9
N$53
  Top 0.152: DECORDER2.12 87.63,38.1 DECORDER2.4 82.45,38.1 80.01,40.54 72.39,40.54 DECODER1.12
N$54  (via drill 0.35)
  Top 0.152: v37.49,35.66 26.52,35.66 22.86,32 18.75,32 17.83,32.92 15.24,32.92 REG_B.9 | v61.27,37.19 71.48,37.19 DECODER1.11
  Bottom 0.152: v37.49,35.66 39.01,37.19 41.6,37.19 46.02,41.6 56.84,41.6 v61.27,37.19
N$56
  Top 0.152: DECODER1.6 64.77,33.07 67.97,33.07 72.08,37.19 89.15,37.19 90.07,38.1 DECORDER2.11
N$57
  Top 0.152: OUTPUT.9 17.07,11.43 22.71,17.07 49.38,17.07 53.65,21.34 61.27,21.34 71.63,31.7 81.23,31.7 DECORDER2.6
N$59
  Top 0.152: PC.9 77.72,19.05 89.15,30.48 DECORDER2.8
REG_A0
  Top 0.152: REG_A.14 15.24,78.03 16.15,78.94 | 16.15,78.94 19.05,81.84 R_REG_A0.1 | 16.15,78.94 18.9,76.2 29.26,76.2 35.51,69.95 39.32,69.95 SELECTOR1.6
REG_A1
  Top 0.152: SELECTOR1.10 46.94,67.36 46.33,67.36 39.78,73.91 32,73.91 29.41,76.5 19.96,76.5 19.05,77.42 R_REG_A1.1
  Bottom 0.152: REG_A.13 15.24,74.98 16.61,74.98 19.05,77.42 R_REG_A1.1
REG_A2
  Top 0.152: REG_A.12 17.83,72.39 19.05,71.17 R_REG_A2.1 19.05,71.02 26.21,63.86 28.35,63.86 41,51.21 41,40.23 39.47,38.71 39.47,38.1 SELECTOR2.6
REG_A3
  Top 0.152: SELECTOR2.10 46.94,35.51 41.76,35.51 40.23,33.98 25.3,33.98 23.01,31.7 14.63,31.7 13.56,32.77 13.56,58.67 19.05,64.16 R_REG_A3.1 19.05,65.99 15.24,69.8 REG_A.11
REG_B0
  Top 0.152: REG_B.14 15.24,46.33 19.05,50.14 R_REG_B0.1
  Bottom 0.152: SELECTOR1.5 39.32,72.39 31.39,64.47 31.39,64.31 19.05,51.97 R_REG_B0.1
REG_B1
  Top 0.152: R_REG_B1.1 16.61,43.28 15.24,43.28 REG_B.13
  Bottom 0.152: R_REG_B1.1 22.25,45.72 46.33,69.8 46.94,69.8 SELECTOR1.11
REG_B2
  Top 0.152: REG_B.12 15.24,40.54 17.98,40.54 19.05,39.47 R_REG_B2.1 19.05,39.32 19.96,38.41 33.38,38.41 35.51,40.54 39.32,40.54 SELECTOR2.5
REG_B3
  Top 0.152: REG_B.11 15.24,37.49 19.05,33.68 | R_REG_B3.1 19.05,33.68 | SELECTOR2.11 41.3,38.1 39.78,36.58 21.95,36.58 19.05,33.68
RST  (via drill 0.35)
  Top 0.152: PC.1 v41.91,11.43 36.27,11.43 34.59,13.11 21.34,13.11 19.96,11.73 19.96,10.36 19.36,9.75 14.63,9.75 5.64,18.75 5.64,26.06 3.81,27.89 JP_CLK_RST.2 3.81,46.48 7.62,50.29 REG_B.1 7.62,50.9 1.98,56.54 1.98,76.35 7.62,81.99 REG_A.1 7.62,82.6 10.36,85.34 85.5,85.34 90.83,80.01 CARRY.13
  Bottom 0.152: v41.91,11.43 OUTPUT.1
VCC  (via drill 0.35)
  Top 0.152: C_REG_B.+ 10.52,27.89 10.52,15.24 C_OUTPUT.+ | PC.7 PC.10 67.67,19.96 67.67,20.73 | 67.67,20.73 67.67,25.3 C_DEC1.+ | C_DEC2.+ 85.34,25.3 75.29,15.24 C_PC.+ | 53.95,19.05 55.63,20.73 67.67,20.73 | OUTPUT.16 35.81,11.43 37.49,9.75 56.24,9.75 56.84,10.36 56.84,16.15 53.95,19.05 | 53.95,19.05 PC.16 | JP_PWR.2 5.03,59.74 10.36,59.74 C_REG_A.+ 10.52,59.74 11.43,60.66 12.8,60.66 12.95,60.5 | 12.95,60.5 v13.72,59.74 | REG_A.16 15.24,81.99 13.56,80.31 13.56,69.49 14.78,68.28 16.31,68.28 16.92,67.67 16.92,64.47 12.95,60.5 | C_SEL1.+ 42.22,59.59 42.22,55.63 46.94,50.9 SELECTOR2.16 | DECORDER2.1 DECODER1.14 72.08,45.72 58.22,59.59 57.45,59.59 C_ALU.+ | DECORDER2.3 82.6,40.69 82.6,43.13 DECORDER2.2 82.6,43.28 85.34,43.28 87.78,45.72 DECORDER2.14 | C_CARRY.+ 89.15,67.67 93.88,72.39 CARRY.10
  Bottom 0.152: OUTPUT.16 33.68,11.43 27.74,17.37 26.36,17.37 25.15,18.59 25.15,19.96 24.38,20.73 16,20.73 10.52,15.24 C_OUTPUT.+ | PC.16 50.75,19.05 42.22,27.58 42.22,27.89 C_SEL2.+ | C_PC.+ 72.39,15.24 PC.10 | REG_B.16 15.24,58.22 v13.72,59.74 | SELECTOR2.16 55.78,59.59 57.3,59.59 C_ALU.+ | DECORDER2.1 82.6,45.72 82.6,43.28 DECORDER2.2 | 92.35,80.31 93.88,81.84 93.88,82.45 CARRY.14 | 92.35,80.31 92.35,73.91 93.88,72.39 CARRY.10 | 92.35,80.31 91.75,80.92 85.95,80.92 84.43,82.45 62.33,82.45 ALU.16 61.27,83.52 53.65,83.52 52.73,82.6 47.09,82.6 SELECTOR1.16 46.02,83.52 38.41,83.52 37.49,82.6 15.24,82.6 REG_A.16 | C_CARRY.+ 89.15,62.18 90.07,61.27 90.07,45.72 DECORDER2.14 90.22,45.72 91.75,44.2 91.75,28.5 87.63,24.38 87.02,24.38 86.11,25.3 85.34,25.3 C_DEC2.+

### Text on the board
Top: copyright KIZITORA.SHIRO